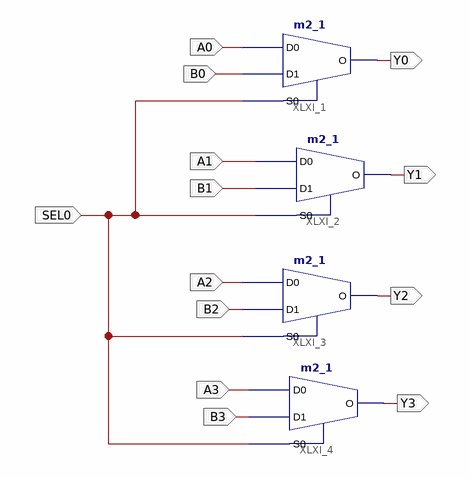
[diagram p0: schematic sheet 1]
// Xilinx ISE schematic mux4_2.sch (xbr) as structural Verilog: 4 symbols, 13 ports
module mux4_2 (
  input  A0,
  input  B0,
  input  A1,
  input  B1,
  input  SEL0,
  input  A2,
  input  B2,
  input  A3,
  input  B3,
  output Y3,
  output Y2,
  output Y1,
  output Y0
);

  m2_1 XLXI_1 (.D0(A0), .D1(B0), .S0(SEL0), .O(Y0));
  m2_1 XLXI_2 (.D0(A1), .D1(B1), .S0(SEL0), .O(Y1));
  m2_1 XLXI_3 (.D0(A2), .D1(B2), .S0(SEL0), .O(Y2));
  m2_1 XLXI_4 (.D0(A3), .D1(B3), .S0(SEL0), .O(Y3));
endmodule
